# EAGLE design arduino_schield (EAGLE 5.07)
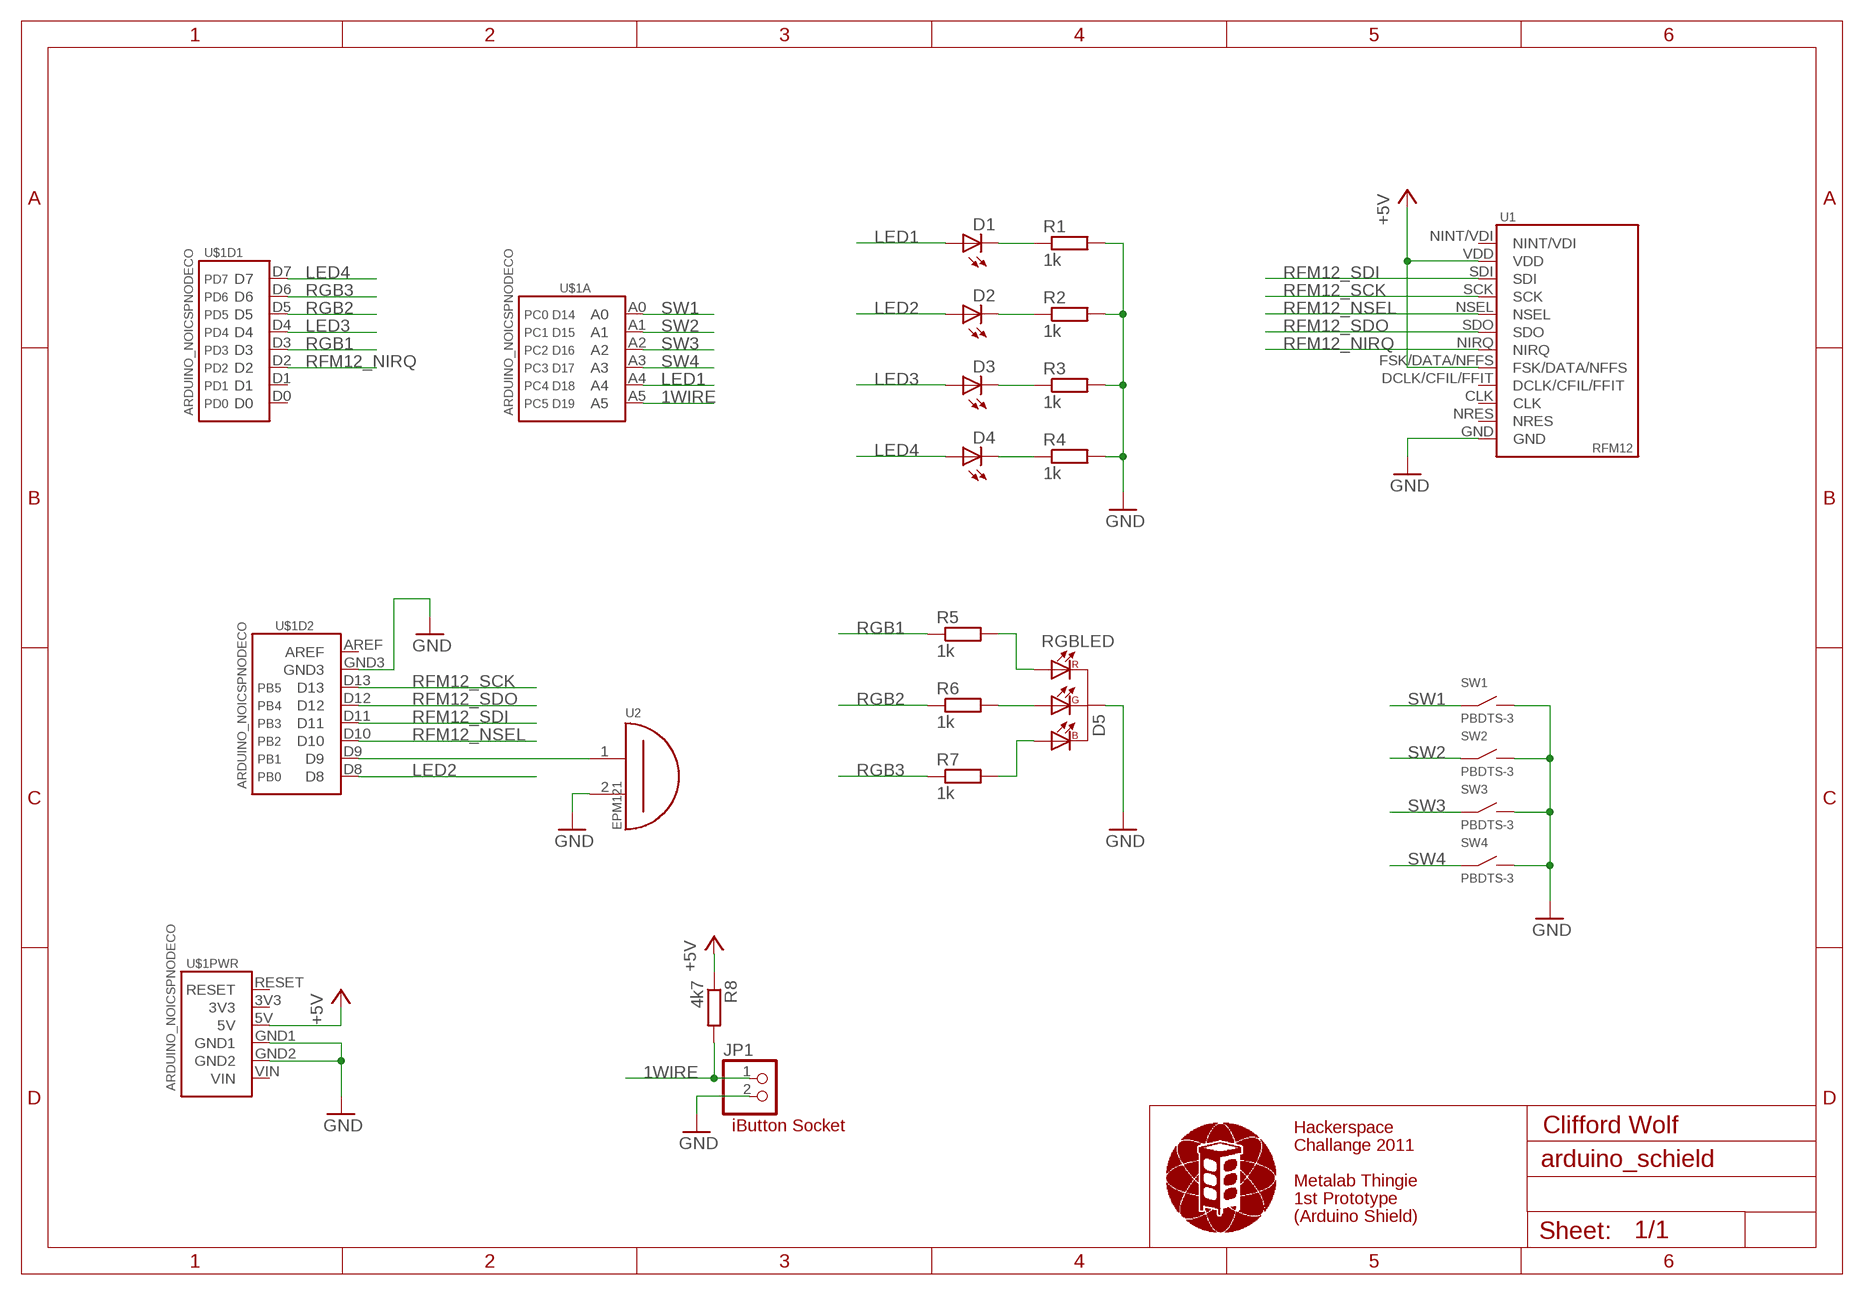
[diagram p0: schematic, sheet 1]

## Parts
D1  LED5MM  [LED5MM]
D2  LED5MM  [LED5MM]
D3  LED5MM  [LED5MM]
D4  LED5MM  [LED5MM]
D5  RGBLED  [RGBLED]
JP1  PINHD-1X2  [1X02]
R1  1k  R0309/10  [0309/10]
R2  1k  R0309/10  [0309/10]
R3  1k  R0309/10  [0309/10]
R4  1k  R0309/10  [0309/10]
R5  1k  R0309/10  [0309/10]
R6  1k  R0309/10  [0309/10]
R7  1k  R0309/10  [0309/10]
R8  4k7  R0309/10  [0309/10]
SW1  PBDTS-3  [DTS-3]
SW2  PBDTS-3  [DTS-3]
SW3  PBDTS-3  [DTS-3]
SW4  PBDTS-3  [DTS-3]
U1  RFM12  [RFM12]
U2  EPM121  [EPM121]
U$1  ARDUINO_NOICSPNODECO  [ARDUINO_NODECO_NOICSP]

## Nets
1WIRE: JP1.1 R8.2 U$1.A5(A:A5)
+5V [pwr]: R8.1 U1.FSK/DATA/NFFS U1.VDD U$1.5V(PWR:5V)
GND [pwr]: D5.C JP1.2 R1.2 R2.2 R3.2 R4.2 SW1.P$2 SW2.P$2 SW3.P$2 SW4.P$2 U1.GND U2.2 U$1.GND1(PWR:GND1) U$1.GND2(PWR:GND2) U$1.GND3(D2:GND3)
LED1: D1.A U$1.A4(A:A4)
LED2: D2.A U$1.D8(D2:D8)
LED3: D3.A U$1.D4(D1:D4)
LED4: D4.A U$1.D7(D1:D7)
N$1: D5.R R5.2
N$2: U2.1 U$1.D9(D2:D9)
N$3: D1.K(C) R1.1
N$4: D5.G R6.2
N$5: D5.B R7.2
N$6: D2.K(C) R2.1
N$11: D3.K(C) R3.1
N$14: D4.K(C) R4.1
RFM12_NIRQ: U1.NIRQ U$1.D2(D1:D2)
RFM12_NSEL: U1.NSEL U$1.D10(D2:D10)
RFM12_SCK: U1.SCK U$1.D13(D2:D13)
RFM12_SDI: U1.SDI U$1.D11(D2:D11)
RFM12_SDO: U1.SDO U$1.D12(D2:D12)
RGB1: R5.1 U$1.D3(D1:D3)
RGB2: R6.1 U$1.D5(D1:D5)
RGB3: R7.1 U$1.D6(D1:D6)
SW1: SW1.P$1 U$1.A0(A:A0)
SW2: SW2.P$1 U$1.A1(A:A1)
SW3: SW3.P$1 U$1.A2(A:A2)
SW4: SW4.P$1 U$1.A3(A:A3)
Unconnected: U1.CLK U1.DCLK/CFIL/FFIT U1.NINT/VDI U1.NRES U$1.3V3(PWR:3V3) U$1.AREF(D2:AREF) U$1.D0(D1:D0) U$1.D1(D1:D1) U$1.RESET(PWR:RESET) U$1.VIN(PWR:VIN)

## Notes on the sheet
- iButton Socket | Hackerspace | Clifford Wolf
- Challange 2011
- Metalab Thingie
- 1st Prototype
- (Arduino Shield)

## Library data of the parts
D1-D4 = mp_diode:LED: LED (5mm)
D5 = mp_diode:RGBLED: LUCKY LIGHT GB-399 Series (Common Cathode)
JP1 = mpc_pinhead:PINHD-1X2: PIN HEADER
R1-R8 = mp_passive:R: RESISTOR, European symbol
SW1-SW4 = mp_switch:PB: Push-Button
U1 = mp_modules:RFM12: RFM12 868 MHz Funk-Transceiver
U2 = mp_modules:EPM121: EPM121 Piezo
U$1 = mp_arduino:ARDUINO_NOICSP: Arduino without ICSP connectors

## Net classes
1 pwr: width 0.508 mm

## Board
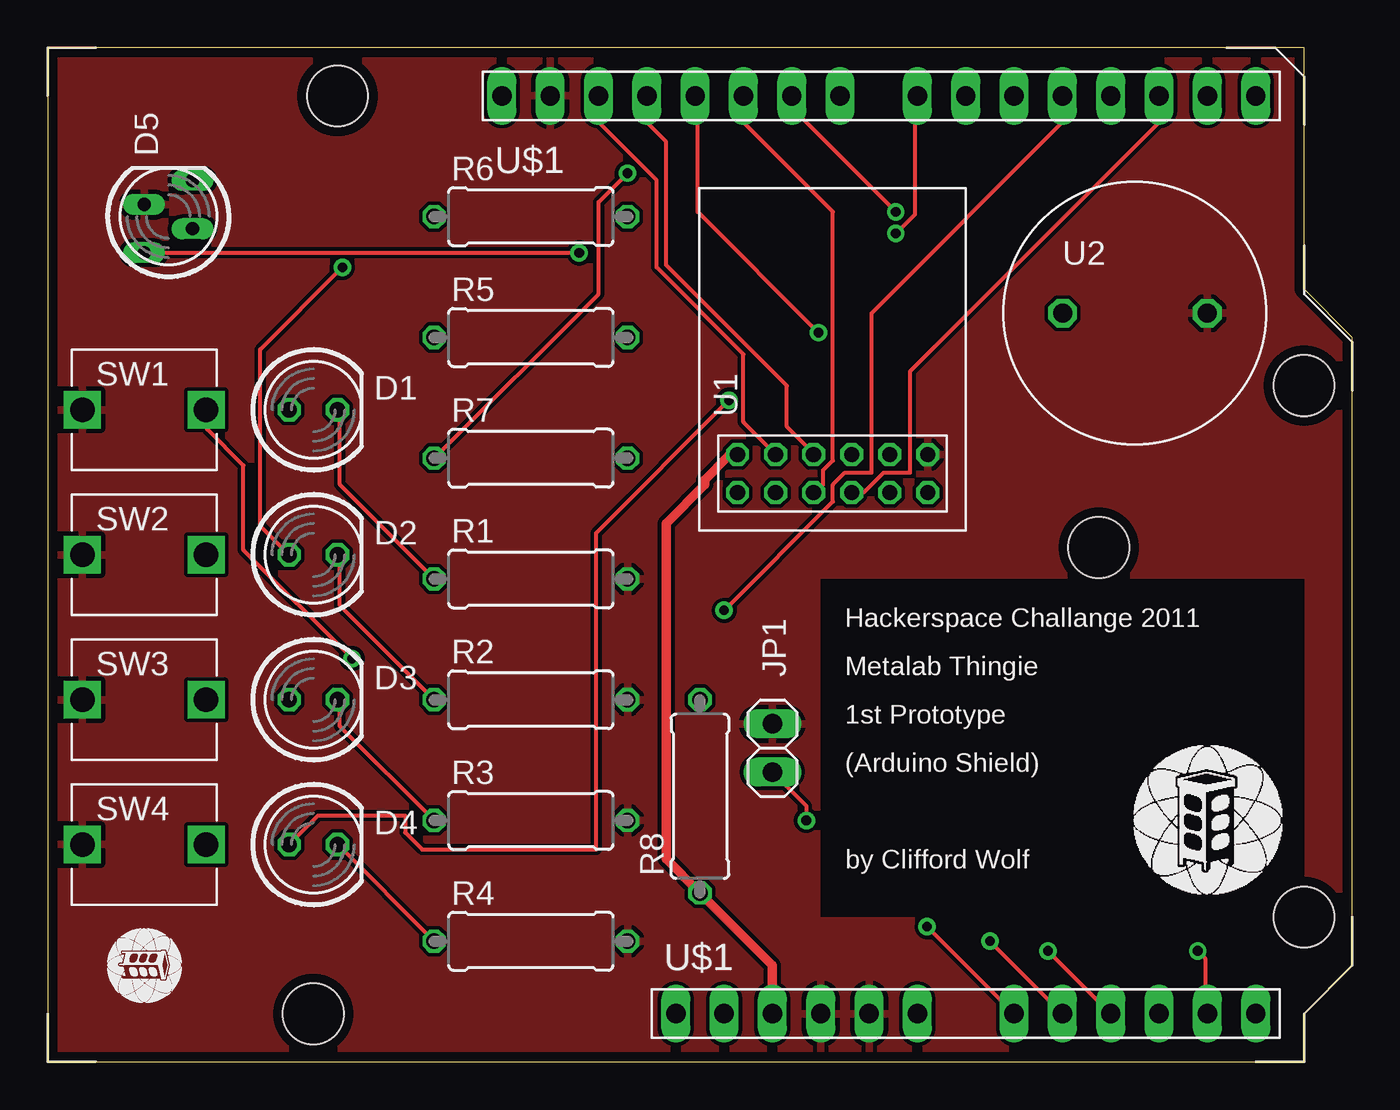
[diagram p1: board, top side]
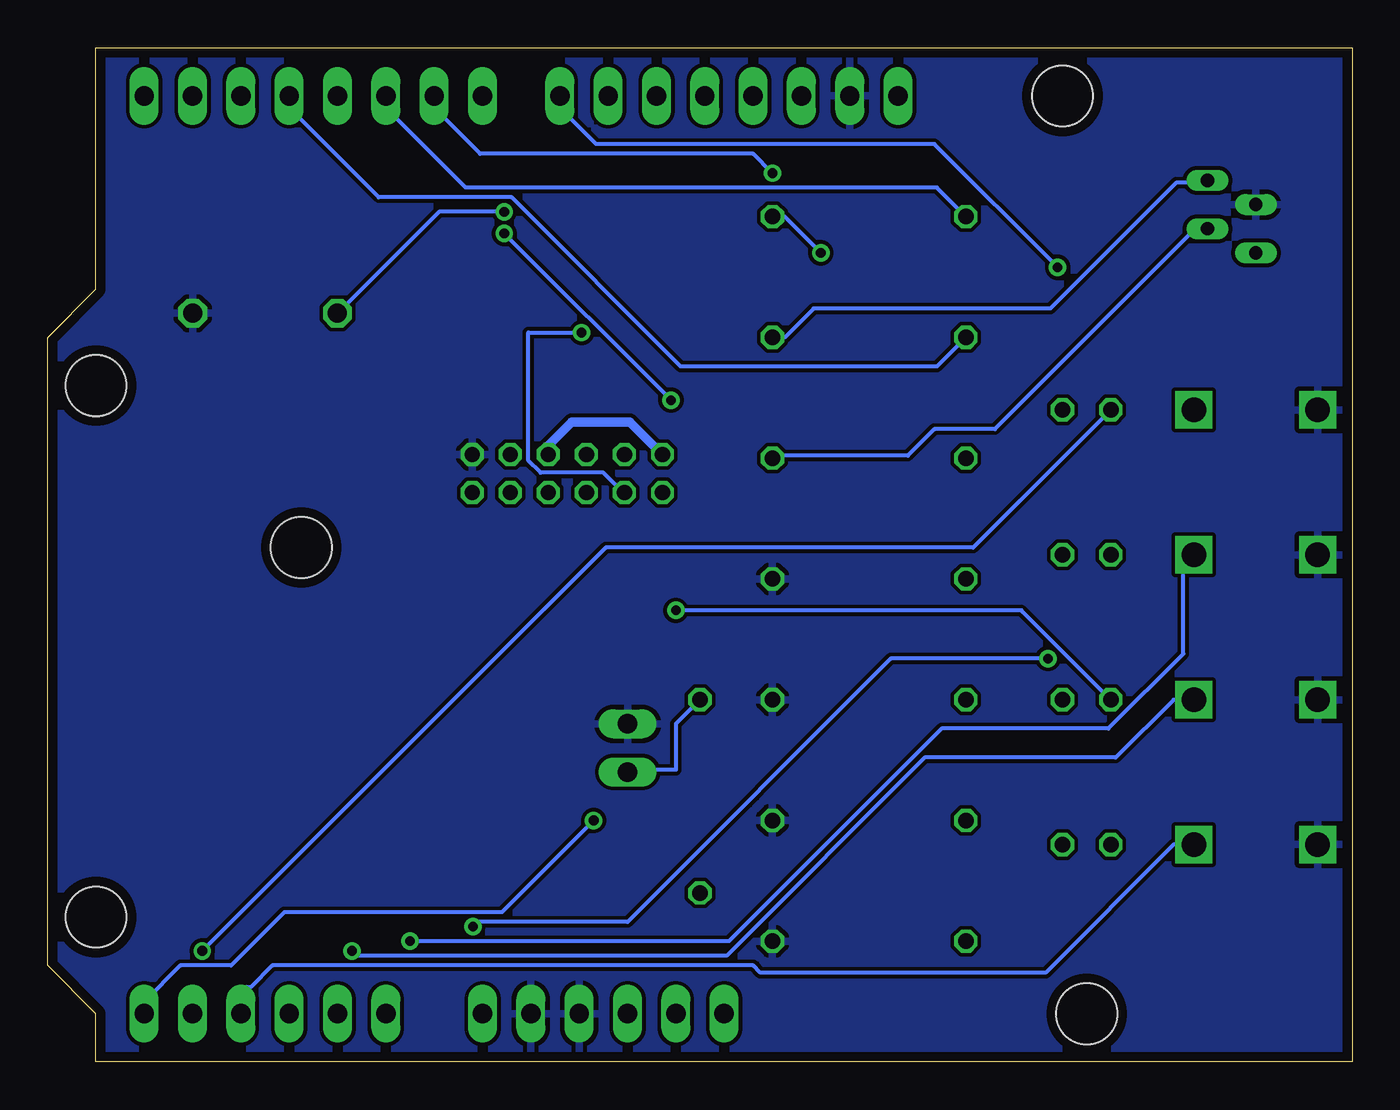
[diagram p2: board, bottom side, seen from below]

Size 68.58 x 53.34 mm. Coordinates in mm from the lower left corner, seen from the top.
Outline: 0,0 66.04,0 66.04,2.54 68.58,5.08 68.58,38.1 66.04,40.64 66.04,53.34 0,53.34 0,0
Copper layers (1*16): Top 0.035mm / dielectric 1.5mm / Bottom 0.035mm
Design rules "qprules_8mil": minimum track width 8mil, minimum drill 20mil, track to track 8mil, track to pad 8mil, pad to pad 8mil, via to via 8mil, smd to smd 8mil, copper to edge 20mil, drill to drill 20mil, minimum pad ring 8mil, minimum via ring 8mil, stop-mask expansion 0mil, vias tented up to drill 0mil, thermal gap 10mil
tRestrict: area 40.6,7.6 to 66,25.4
vRestrict: area 40.6,7.6 to 66,25.4

### Footprints (pad centres in the part's own frame; a part is rotated, then mirrored left to right if it is on the bottom)
LED5MM = drill 0.813 octagon: A -1.27,0; K 1.27,0
RGBLED = drill 0.7 long: B -0.635,-1.27; C 0.635,1.27; G -1.905,1.27; R 1.905,-1.27
1X02 = drill 1.016 long: 1 -1.27,0; 2 1.27,0
0309/10 = drill 0.813 octagon: 1 -5.08,0; 2 5.08,0
DTS-3 = drill 1.3 square: P$1 3.25,0; P$2 -3.25,0
RFM12 = drill 0.8 octagon: CLK 4,4; DCLK/CFIL/FFIT 2,4; FSK/DATA/NFFS 4,6; GND 4,2; NINT/VDI 2,12; NIRQ 2,6; NRES 2,2; NSEL 2,8; SCK 4,10; SDI 2,10; SDO 4,8; VDD 4,12
EPM121 = drill 1 octagon: 1 -3.8,0; 2 3.8,0
ARDUINO_NODECO_NOICSP = drill 1.016 long: 3V3 35.56,2.54; 5V 38.1,2.54; A0 50.8,2.54; A1 53.34,2.54; A2 55.88,2.54; A3 58.42,2.54; A4 60.96,2.54; A5 63.5,2.54; AREF 23.876,50.8; D0 63.5,50.8; D1 60.96,50.8; D2 58.42,50.8; D3 55.88,50.8; D4 53.34,50.8; D5 50.8,50.8; D6 48.26,50.8; D7 45.72,50.8; D8 41.656,50.8; D9 39.116,50.8; D10 36.576,50.8; D11 34.036,50.8; D12 31.496,50.8; D13 28.956,50.8; GND1 40.64,2.54; GND2 43.18,2.54; GND3 26.416,50.8; RESET 33.02,2.54; VIN 45.72,2.54 | hole 3.2: 66.04,35.56; 66.04,7.62; 15.24,50.8; 13.97,2.54; 55.245,27.051

### Placement (x,y rotation side)
D1  13.97,34.29 0 top
D2  13.97,26.67 0 top
D3  13.97,19.05 0 top
D4  13.97,11.43 0 top
D5  6.35,44.45 90 top
JP1  38.1,16.51 90 top
R1  25.4,25.4 0 top
R2  25.4,19.05 0 top
R3  25.4,12.7 0 top
R4  25.4,6.35 0 top
R5  25.4,38.1 0 top
R6  25.4,44.45 0 top
R7  25.4,31.75 0 top
R8  34.29,13.97 90 top
SW1  5.08,34.29 0 top
SW2  5.08,26.67 0 top
SW3  5.08,19.05 0 top
SW4  5.08,11.43 0 top
U1  48.26,27.94 90 top
U2  57.15,39.37 0 top
U$1  0,0 0 top
U$3  [METALAB]  5.08,5.08 270 top
U$5  [METALAB_MEDIUM]  60.96,12.7 0 top

### Tracks (layer width: path | path; a pad name or v marks a point on that pad's centre or on a via)
1WIRE  (via drill 0.51)
  Top 0.203: JP1.1 39.88,13.46 v39.88,12.7
  Bottom 0.203: v39.88,12.7 44.7,7.87 56.13,7.87 58.93,5.08 61.59,5.08 63.5,3.17 U$1.A5 | R8.2 35.56,17.78 35.56,15.37 37.97,15.37 JP1.1
+5V
  Top 0.508: U1.VDD 36.2,31.88 35.81,31.88 34.54,30.61 34.54,30.35 32.51,28.32 32.51,10.67 R8.1 38.1,5.08 U$1.5V
  Bottom 0.508: U1.FSK/DATA/NFFS 42.29,32 42.29,32.38 41.02,33.66 37.97,33.66 36.32,32 U1.VDD 36.2,32.13
GND
  pour Bottom: 0,53.34 64.77,53.34 66.04,52.07 66.04,40.64 68.58,38.1 68.58,5.08 66.04,2.54 66.04,0 0,0
  pour Top: 0,53.34 64.77,53.34 66.04,52.07 66.04,40.64 68.58,38.1 68.58,5.08 66.04,2.54 66.04,0 0,0
LED1  (via drill 0.51)
  Top 0.203: v60.45,5.84 60.83,5.46 60.83,2.67 U$1.A4
  Bottom 0.203: D1.A 19.94,27.05 39.24,27.05 v60.45,5.84
LED2  (via drill 0.51)
  Top 0.203: D2.A 11.18,28.19 11.18,37.47 v15.49,41.78
  Bottom 0.203: v15.49,41.78 21.97,48.26 39.75,48.26 41.66,50.16 U$1.D8
LED3  (via drill 0.51)
  Top 0.203: v35.56,23.75 41.27,29.46 41.27,30.35 41.91,30.99 43.31,30.99 43.31,39.37 53.34,49.4 U$1.D4
  Bottom 0.203: D3.A 17.4,23.75 v35.56,23.75
LED4  (via drill 0.51)
  Top 0.203: D4.A 14.22,12.95 18.8,12.95 18.8,12.06 19.68,11.18 28.83,11.18 28.83,27.81 v35.81,34.8 | v44.58,43.56 45.59,44.58 45.59,50.67 U$1.D7
  Bottom 0.203: v35.81,34.8 v44.58,43.56
N$1
  Bottom 0.203: D5.R 8.26,46.35 8.38,46.23 9.27,46.23 15.88,39.62 28.32,39.62 29.84,38.1 R5.2
N$2  (via drill 0.51)
  Top 0.203: v44.58,44.7 39.12,50.16 U$1.D9
  Bottom 0.203: v44.58,44.7 48.01,44.7 U2.1
N$3
  Top 0.203: R1.1 15.37,30.35 15.37,34.16 D1.K
N$4  (via drill 0.51)
  Top 0.203: D5.G v27.94,42.55
  Bottom 0.203: v27.94,42.55 29.84,44.45 R6.2
N$5
  Bottom 0.203: D5.B 8.26,43.81 18.8,33.27 21.97,33.27 23.37,31.88 30.35,31.88 R7.2
N$6
  Top 0.203: R2.1 15.37,24 15.37,26.54 D2.K
N$11
  Top 0.203: R3.1 15.37,17.65 15.37,18.92 D3.K
N$14
  Top 0.203: R4.1 D4.K
RFM12_NIRQ
  Top 0.203: U$1.D2 58.42,49.4 45.34,36.32 45.34,30.99 43.94,30.99 42.93,29.97 42.29,29.97 U1.NIRQ
RFM12_NSEL
  Top 0.203: U$1.D10 36.58,49.4 41.27,44.7 41.27,31.62 40.77,31.11 40.77,30.35 40.39,29.97 U1.NSEL
RFM12_SCK
  Top 0.203: U$1.D13 28.96,49.4 32,46.35 32,41.78 36.58,37.21 36.58,33.66 38.23,32 U1.SCK
RFM12_SDI  (via drill 0.51)
  Top 0.203: v40.51,38.35 34.16,44.7 34.16,50.67 U$1.D11
  Bottom 0.203: v40.51,38.35 43.31,38.35 43.31,31.62 42.67,30.99 39.37,30.99 38.35,29.97 U1.SDI
RFM12_SDO
  Top 0.203: U$1.D12 31.5,49.4 32.51,48.39 32.51,41.91 38.86,35.56 38.86,33.4 40.26,32 U1.SDO
RGB1
  Bottom 0.203: R5.1 21.84,36.58 35.31,36.58 44.2,45.47 51.18,45.47 55.88,50.16 U$1.D3
RGB2
  Bottom 0.203: R6.1 21.84,45.97 46.61,45.97 50.8,50.16 U$1.D5
RGB3  (via drill 0.51)
  Top 0.203: R7.1 28.96,40.39 28.96,45.21 v30.48,46.74
  Bottom 0.203: v30.48,46.74 31.5,47.75 45.85,47.75 48.26,50.16 U$1.D6
SW1  (via drill 0.51)
  Top 0.203: v46.23,7.11 U$1.A0 | v16,21.21 10.29,26.92 10.29,31.37 8.38,33.27 8.38,34.29 SW1.P$1
  Bottom 0.203: v46.23,7.11 45.97,7.37 38.1,7.37 24.26,21.21 v16,21.21
SW2  (via drill 0.51)
  Top 0.203: v49.53,6.35 U$1.A1
  Bottom 0.203: v49.53,6.35 32.77,6.35 21.59,17.53 12.83,17.53 8.89,21.46 8.89,26.67 SW2.P$1
SW3  (via drill 0.51)
  Top 0.203: v52.58,5.84 U$1.A2
  Bottom 0.203: v52.58,5.84 52.32,5.59 32.89,5.59 22.48,16 12.45,16 9.4,19.05 SW3.P$1
SW4
  Bottom 0.203: U$1.A3 58.42,3.94 57.91,3.94 56.77,5.08 31.5,5.08 31.11,4.7 16.13,4.7 9.4,11.43 SW4.P$1

### Text on the board
tPlace: Hackerspace Challange 2011 | Metalab Thingie | 1st Prototype | (Arduino Shield) | by Clifford Wolf